# Altium schematic sheet P07.Flash.SchDoc
size A4
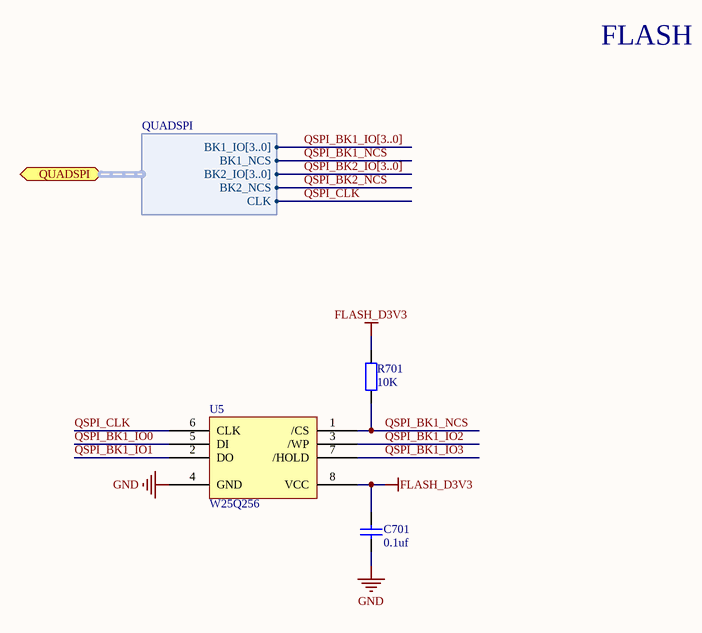
[diagram p0: P07.Flash.SchDoc]

## Parts
C701  value 0.1uf  [C0603]  (hidden comment: Cap)
R701  value 10K  [R0603]  (hidden comment: Res)
U5  W25Q256  [W25Q256-WSON8-8X6]

## Ports
QUADSPI (bidir, harness QUADSPI)

## Harnesses
QUADSPI: BK1_IO[3..0], BK1_NCS, BK2_IO[3..0], BK2_NCS, CLK

## Nets
FLASH_D3V3: C701.2 R701.2 U5.8(VCC)
GND: C701.1 U5.4(GND)
QSPI_BK1_IO0: U5.5(DI)
QSPI_BK1_IO1: U5.2(DO)
QSPI_BK1_IO2: U5.3(/WP)
QSPI_BK1_IO3: U5.7(/HOLD)
QSPI_BK1_NCS: R701.1 U5.1(/CS) ; port QUADSPI.BK1_NCS
QSPI_BK2_NCS: port QUADSPI.BK2_NCS
QSPI_CLK: U5.6(CLK) ; port QUADSPI.CLK

## Buses and harness runs
bus QSPI_BK1_IO[3..0]
bus QSPI_BK2_IO[3..0]

## Notes on the sheet
- FLASH

## Library data of the parts
R701 = Res: 电阻
U5 = W25Q256: 256M-BIT SERIAL FLASH MEMORY WITH DUAL, QUAD SPI